# EAGLE design LED-Reorg-SMD (EAGLE 9.1.1)
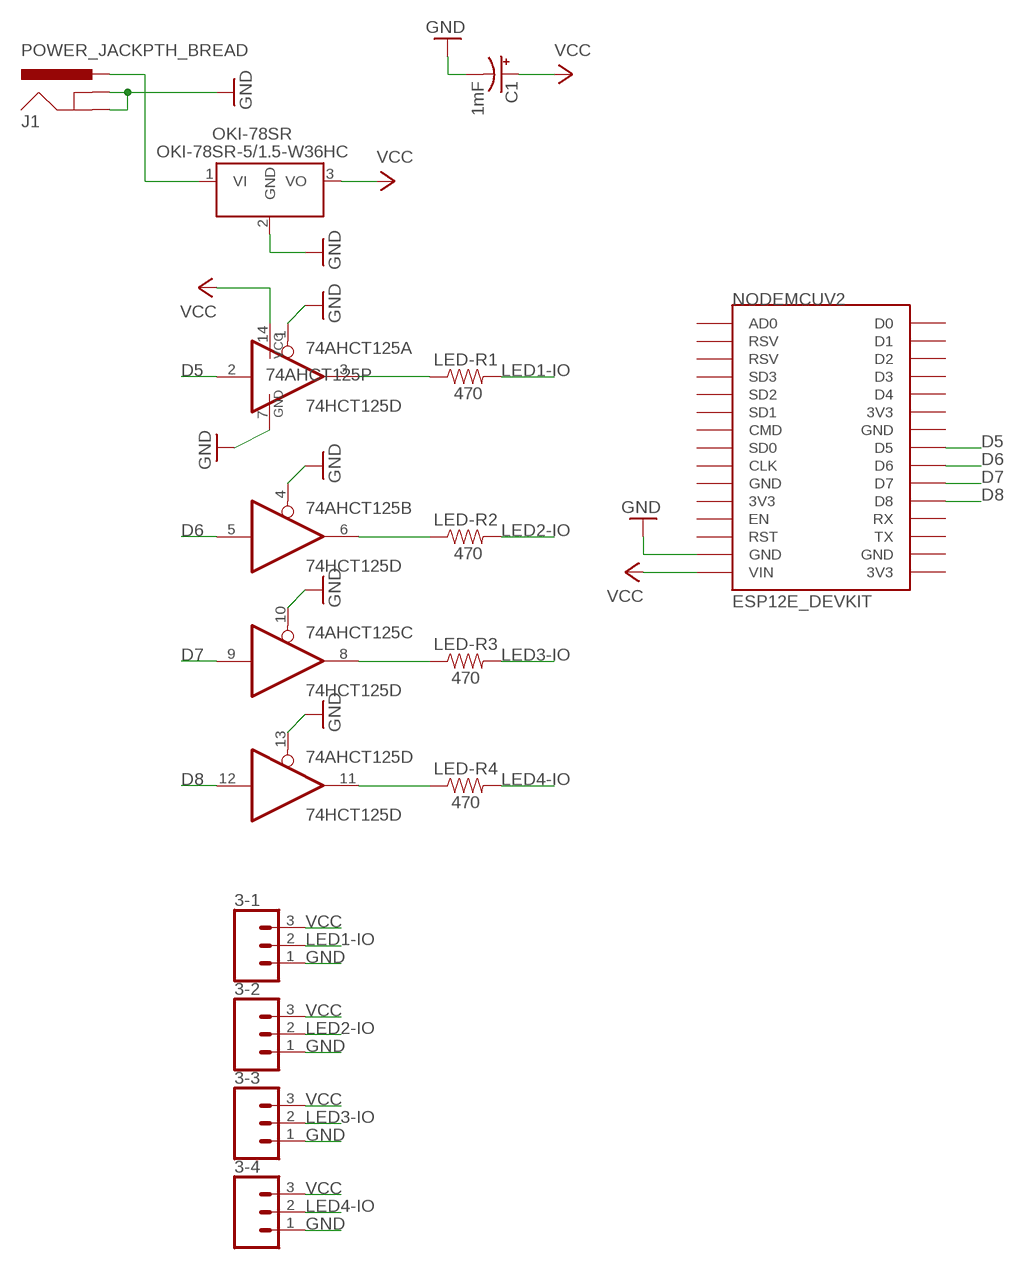
[diagram p0: schematic, sheet 1]

## Parts
3-1  CONN_03SCREW  [SCREWTERMINAL-3.5MM-3]
3-2  CONN_03SCREW  [SCREWTERMINAL-3.5MM-3]
3-3  CONN_03SCREW  [SCREWTERMINAL-3.5MM-3]
3-4  CONN_03SCREW  [SCREWTERMINAL-3.5MM-3]
74AHCT125  74HCT125D  [SO14]
C1  1mF  1000UF-RADIAL-5MM-25V-20%  [CPOL-RADIAL-5MM-10MM]
J1  POWER_JACKPTH_BREAD  [POWER_JACK_PTH_BREAD]
LED-R1  470  RESISTOR1206  [1206]
LED-R2  470  RESISTOR1206  [1206]
LED-R3  470  RESISTOR1206  [1206]
LED-R4  470  RESISTOR1206  [1206]
NODEMCUV2  ESP12E_DEVKIT  [ESP12E_DEVKIT]
OKI-78SR  OKI-78SR-5/1.5-W36HC  [OKI-78SR_HORIZ]

## Nets
D5: 74AHCT125.2(A:I) NODEMCUV2.D5
D6: 74AHCT125.5(B:I) NODEMCUV2.D6
D7: 74AHCT125.9(C:I) NODEMCUV2.D7
D8: 74AHCT125.12(D:I) NODEMCUV2.D8
GND: 3-1.1 3-2.1 3-3.1 3-4.1 74AHCT125.1(A:OE) 74AHCT125.4(B:OE) 74AHCT125.7(P:GND) 74AHCT125.10(C:OE) 74AHCT125.13(D:OE) C1.- J1.GND J1.GNDBREAK NODEMCUV2.GND@1(GND) OKI-78SR.2(GND)
LED1-IO: 3-1.2 LED-R1.2
LED2-IO: 3-2.2 LED-R2.2
LED3-IO: 3-3.2 LED-R3.2
LED4-IO: 3-4.2 LED-R4.2
N$1: 74AHCT125.3(A:O) LED-R1.1
N$2: 74AHCT125.6(B:O) LED-R2.1
N$3: 74AHCT125.8(C:O) LED-R3.1
N$4: 74AHCT125.11(D:O) LED-R4.1
N$10: J1.PWR OKI-78SR.1(VI)
VCC: 3-1.3 3-2.3 3-3.3 3-4.3 74AHCT125.14(P:VCC) C1.+ NODEMCUV2.VIN OKI-78SR.3(VO)
Unconnected: NODEMCUV2.3V3@0(3V3) NODEMCUV2.3V3@1(3V3) NODEMCUV2.3V3@2(3V3) NODEMCUV2.AD0 NODEMCUV2.CLK NODEMCUV2.CMD NODEMCUV2.D0 NODEMCUV2.D1 NODEMCUV2.D2 NODEMCUV2.D3 NODEMCUV2.D4 NODEMCUV2.EN NODEMCUV2.GND@0(GND) NODEMCUV2.GND@2(GND) NODEMCUV2.GND@3(GND) NODEMCUV2.RST NODEMCUV2.RSV@0(RSV) NODEMCUV2.RSV@1(RSV) NODEMCUV2.RX NODEMCUV2.SD0 NODEMCUV2.SD1 NODEMCUV2.SD2 NODEMCUV2.SD3 NODEMCUV2.TX

## Library data of the parts
3-1-3-4 = SparkFun-Connectors:CONN_03: Multi connection point. Often used as Generic Header-pin footprint for 0.1 inch spaced/style header connections On any of the 0.1 inch spaced packages, you can populate with these: Break Away Headers - Straight <https://www.sparkfun.com/products/116> (PRT-00116) Break Away Male Headers - Right Angle <https://www.sparkfun.com/products/553> (PRT-00553) Female Headers <https://www.sparkfun.com/products/115> (PRT-00115) Break Away Headers - Machine Pin <https://www.sparkfun.com/products/117> (PRT-00117) Break Away Female Headers - Swiss Machine Pin <https://www.sparkfun.com/products/743> (PRT-00743) Stackable Header - 3 Pin (Female, 0.1") <https://www.sparkfun.com/products/13875> (PRT-13875) For SCREWTERMINALS and SPRING TERMINALS visit here: Screw Terimnals on SparkFun.com <https://www.sparkfun.com/search/results?term=Screw+Terminals> (5mm/3.5mm/2.54mm spacing) This device is also useful as a general connection point to wire up your design to another part of your project. Our various solder wires solder well into these plated through hole pads. Hook-Up Wire - Assortment (Stranded, 22 AWG) <https://www.sparkfun.com/products/11375> (PRT-11375) Hook-Up Wire - Assortment (Solid Core, 22 AWG) <https://www.sparkfun.com/products/11367> (PRT-11367) View the entire wire category on our website here <https://www.sparkfun.com/categories/141> Special notes: Molex polarized connector foot print use with SKU : PRT-08232 with associated crimp pins and housings.; PROD_ID: CONN-08288; SF_ID: PRT-08235
74AHCT125 = 74xx-eu:74*125: Quad bus BUFFER, 3-state
C1 = SparkFun-Capacitors:1000UF: 1,000µF/1mF ceramic capacitors A capacitor is a passive two-terminal electrical component used to store electrical energy temporarily in an electric field. CAP-08070; PROD_ID: CAP-09538
J1 = SparkFun-Connectors:POWER_JACK: Power Jack Connector This is the standard 5.5mm barrel jack for power. The PTH is the most common, proven, reliable, footprint. The Slot footprint only works if the mill layer is transmitted to the PCB fab house so be warned. Here are the connectors we sell at SparkFun: DC Barrel Power Jack/Connector <https://www.sparkfun.com/products/119> (PRT-00119) DC Barrel Power Jack/Connector (SMD) <https://www.sparkfun.com/products/12748> (PRT-12748) DC Barrel Jack Adapter - Breadboard Compatible <https://www.sparkfun.com/products/10811> (PRT-10811) It is used on this SparkFun product (and many, many others): SparkFun RedBoard - Programmed with Arduino <https://www.sparkfun.com/products/12757> (DEV-12757) Also, if you need a mating power supply or connector, please check these out: Wall Adapter Power Supply - 9VDC 650mA <https://www.sparkfun.com/products/298> (TOL-00298) DC Barrel Jack Adapter - Male <https://www.sparkfun.com/products/10287> (PRT-10287); PROD_ID: PRT-10811
LED-R1-LED-R4 = SparkFun-Resistors:RESISTOR: Generic Resistor Package
NODEMCUV2 = ESP12E_DEVKIT:ESP12E_DEVKIT: ESP12E DEVKIT BOARD
OKI-78SR = MRDT-ICs:OKI-78SR-*/1.5-W36?C: 4.95W DC/DC Converter Manufacturer: Murata; VOUT: +5v

## Board
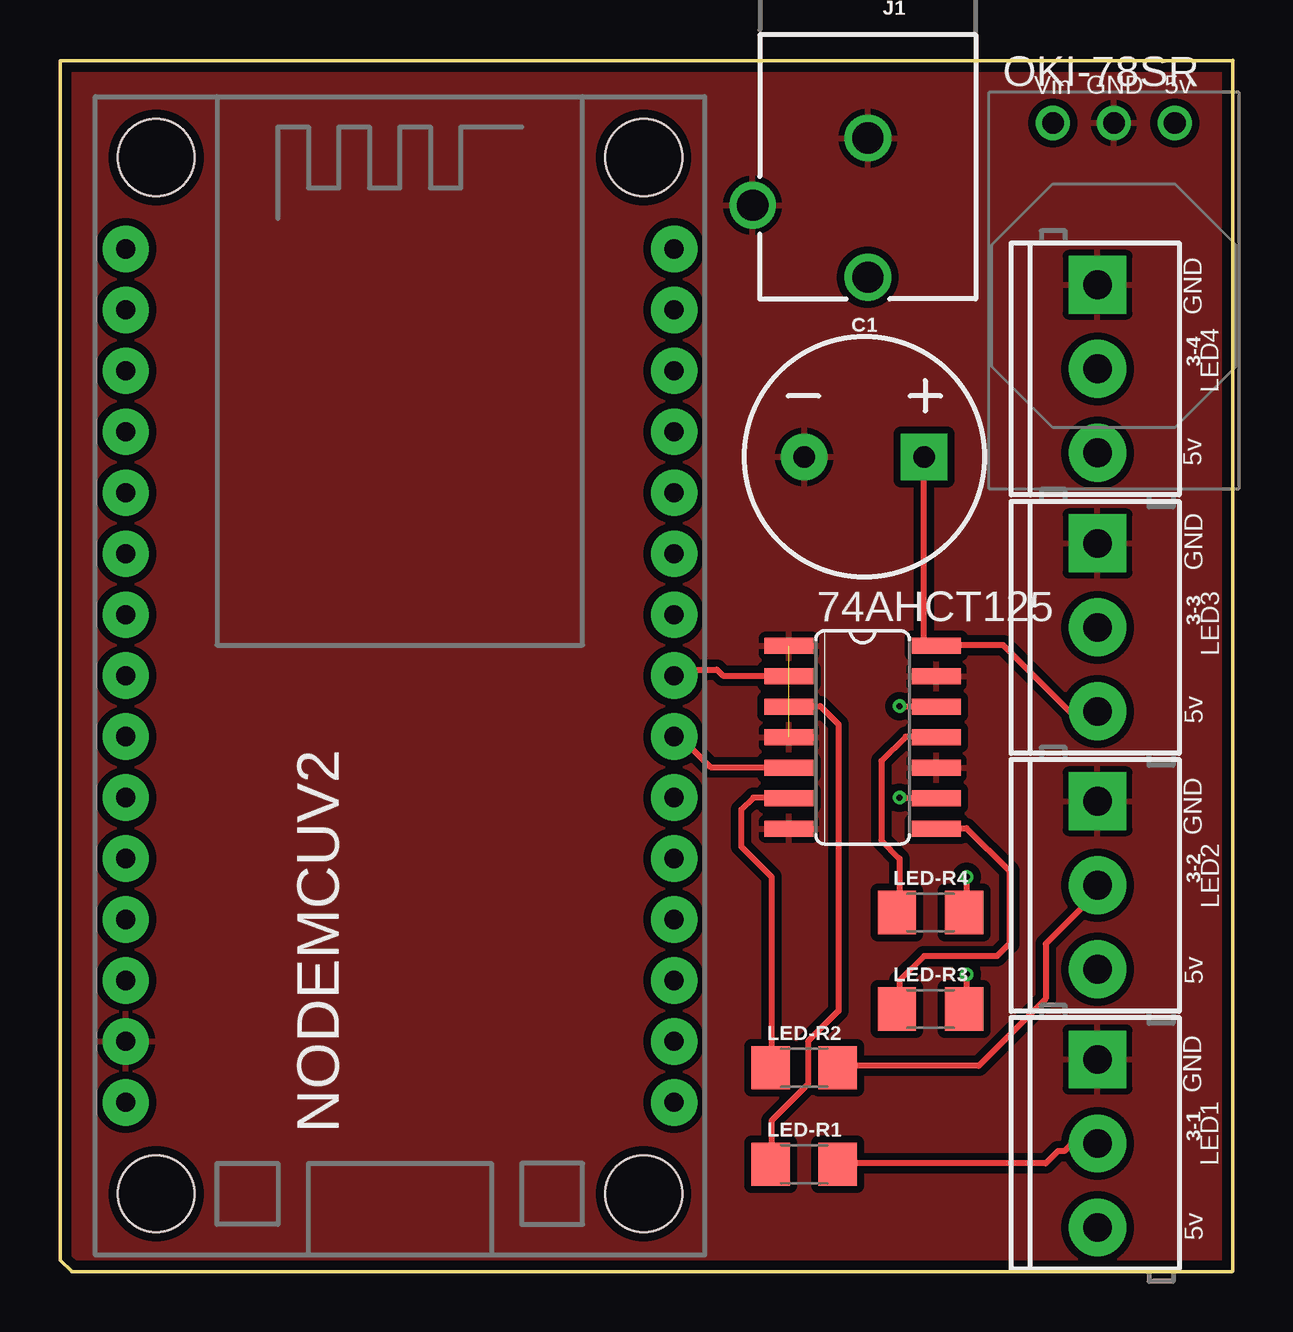
[diagram p1: board, top side]
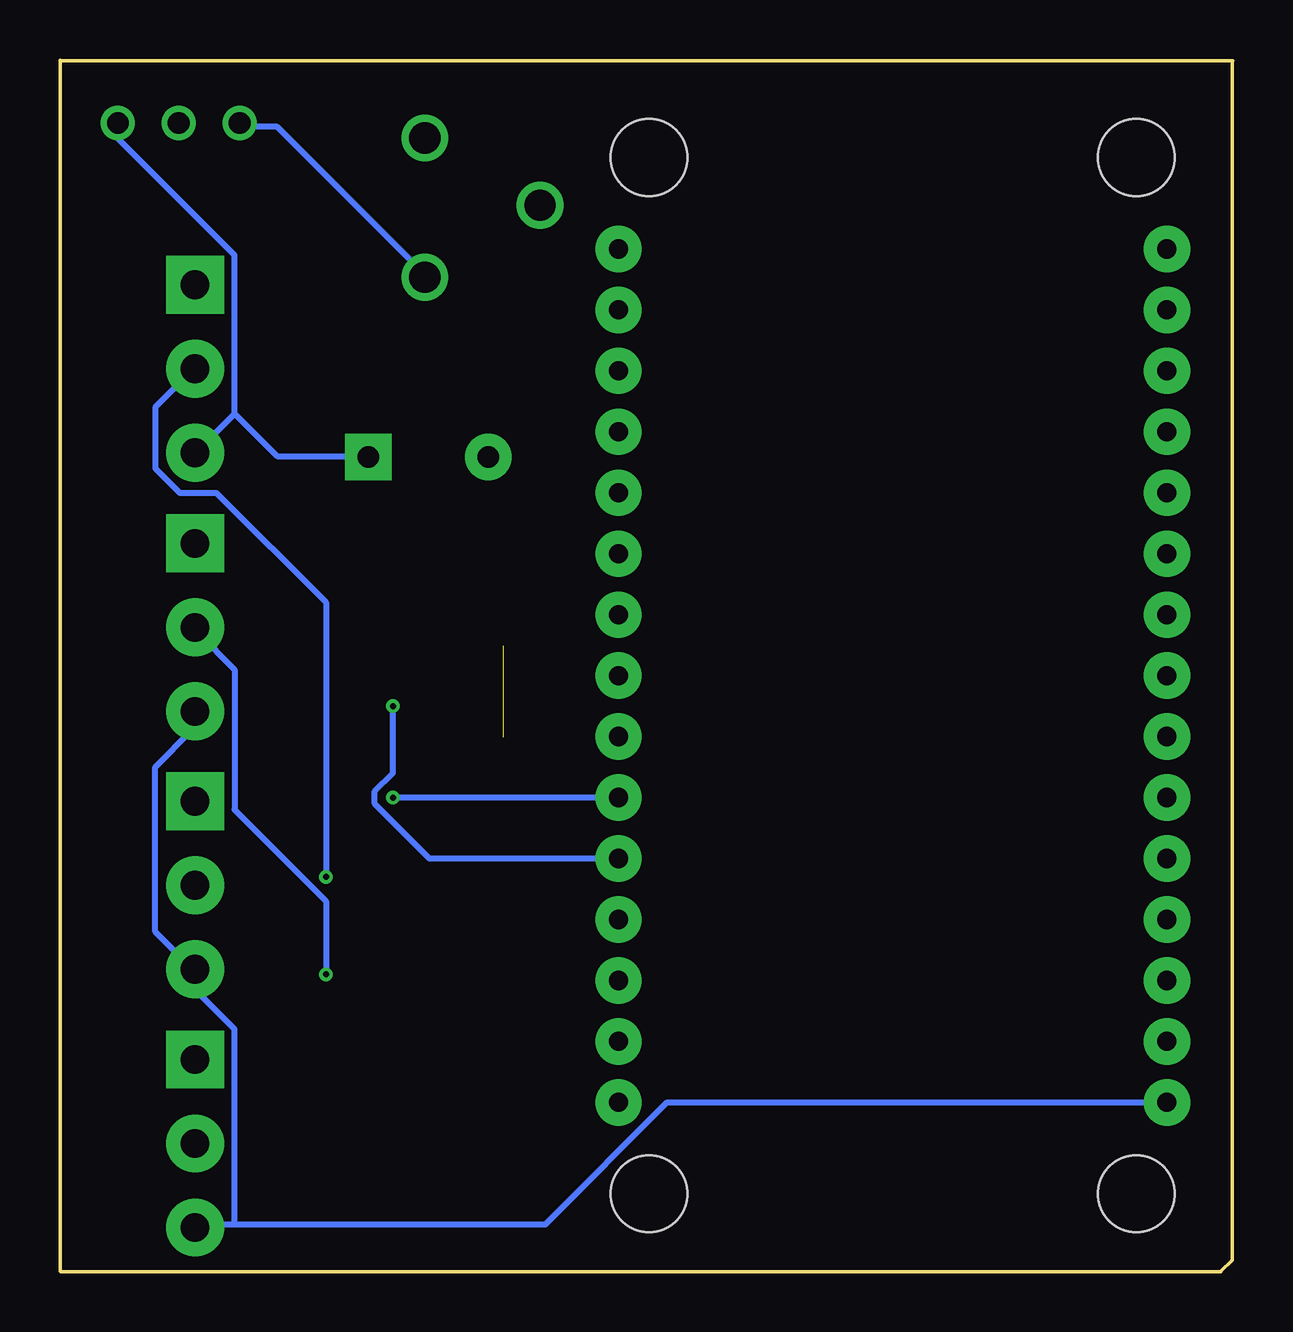
[diagram p2: board, bottom side, seen from below]

Size 48.88 x 50.49 mm. Coordinates in mm from the lower left corner, seen from the top.
Outline: 0.01,50.43 0.01,0.51 0.03,0.49
Outline: 0,50.47 48.86,50.47 48.88,50.49 48.88,0.03 48.85,0 0.53,0 0.52,0
Outline: 0.02,0.49 0.5,0.01 0.5,0.01
Copper layers (1*16): Top 0.035559375mm / dielectric 1.6mm / Bottom 0.035559375mm
Design rules "oshpark-2layer-auto-routing": minimum track width 10mil, minimum drill 10mil, track to track 10mil, track to pad 8mil, pad to pad 8mil, via to via 8mil, smd to smd 6mil, copper to edge 15mil, drill to drill 6mil, minimum pad ring 6mil, minimum via ring 6mil, stop-mask expansion 2.5mil, vias tented up to drill 0mil, thermal gap 10mil

### Footprints (pad centres in the part's own frame; a part is rotated, then mirrored left to right if it is on the bottom)
SCREWTERMINAL-3.5MM-3 = drill 1.2 pad 2.413 square: 1 0,0 | drill 1.2 pad 2.413: 2 3.5,0; 3 7,0
SO14 = smd 0.66 x 2.032: 1 -3.81,-3.073; 2 -2.54,-3.073; 3 -1.27,-3.073; 4 0,-3.073; 5 1.27,-3.073; 6 2.54,-3.073; 7 3.81,-3.073; 8 3.81,3.073; 9 2.54,3.073; 10 1.27,3.073; 11 0,3.073; 12 -1.27,3.073; 13 -2.54,3.073; 14 -3.81,3.073
CPOL-RADIAL-5MM-10MM = drill 0.9 pad 1.93 square: + 2.5,0 | drill 0.9 pad 1.93: - -2.5,0
POWER_JACK_PTH_BREAD = drill 1.3: GND 0,7.9; GNDBREAK 4.8,10.7; PWR 0,13.7
1206 = smd 1.6 x 1.8: 1 -1.4,0; 2 1.4,0
ESP12E_DEVKIT = drill 0.8 pad 1.93: 3V3@0 -11.43,-7.62; 3V3@1 11.43,5.08; 3V3@2 11.43,-17.78; AD0 -11.43,17.78; CLK -11.43,-2.54; CMD -11.43,2.54; D0 11.43,17.78; D1 11.43,15.24; D2 11.43,12.7; D3 11.43,10.16; D4 11.43,7.62; D5 11.43,0; D6 11.43,-2.54; D7 11.43,-5.08; D8 11.43,-7.62; EN -11.43,-10.16; GND@0 -11.43,-5.08; GND@1 -11.43,-15.24; GND@2 11.43,2.54; GND@3 11.43,-15.24; RST -11.43,-12.7; RSV@0 -11.43,15.24; RSV@1 -11.43,12.7; RX 11.43,-10.16; SD0 -11.43,0; SD1 -11.43,5.08; SD2 -11.43,7.62; SD3 -11.43,10.16; TX 11.43,-12.7; VIN -11.43,-17.78 | hole 3.2: -10.16,21.59; 10.16,21.59; 10.16,-21.59; -10.16,-21.59
OKI-78SR_HORIZ = drill 0.9 pad 1.422: 1 0,0; 2 -2.54,0; 3 -5.08,0

### Placement (x,y rotation side)
3-1  43.25,8.85 270 top
3-2  43.25,19.6 270 top
3-3  43.25,30.35 270 top
3-4  43.25,41.12 270 top
74AHCT125  33.46,22.27 270 top
C1  33.53,33.95 0 top
J1  33.67,55.14 180 top
LED-R1  31.02,4.48 0 top
LED-R2  31.02,8.5 0 top
LED-R3  36.29,10.95 0 top
LED-R4  36.29,14.97 0 top
NODEMCUV2  14.17,24.84 0 top
OKI-78SR  41.39,47.87 180 top

### Tracks (layer width: path | path; a pad name or v marks a point on that pad's centre or on a via)
D5
  Top 0.254: NODEMCUV2.D5 25.85,25.09 27.38,25.09 27.63,24.84 30.17,24.84 74AHCT125.2
D6
  Top 0.254: NODEMCUV2.D6 25.85,22.3 27.12,21.03 30.17,21.03 74AHCT125.5
D7  (via drill 0.25)
  Top 0.254: v35,19.76 36.52,19.76 74AHCT125.9
  Bottom 0.254: NODEMCUV2.D7 v35,19.76
D8  (via drill 0.25)
  Top 0.254: v35,23.57 36.52,23.57 74AHCT125.12
  Bottom 0.254: v35,23.57 35,20.77 35.76,20.01 35.76,19.5 33.47,17.22 NODEMCUV2.D8
GND  (1 unrouted)
  pour Top (isolate 0.305): 0.01,0.52 0.01,50.46 0.01,50.46 48.87,50.46 48.87,50.47 48.87,0.03 48.85,0.01 0.5,0.01 0.03,0.49
LED1-IO
  Top 0.254: LED-R1.2 32.46,4.52 41.09,4.52 41.6,5.03 41.86,5.03 42.11,5.28 43.13,5.28 3-1.2
LED2-IO
  Top 0.254: LED-R2.2 32.46,8.58 38.3,8.58 41.09,11.38 41.09,13.66 43.38,15.95 3-2.2
LED3-IO  (via drill 0.25)
  Top 0.254: v37.79,12.39 37.79,11.12 LED-R3.2
  Bottom 0.254: v37.79,12.39 37.79,15.44 41.6,19.25 41.6,25.09 43.13,26.62 3-3.2
LED4-IO  (via drill 0.25)
  Top 0.254: v37.79,16.46 37.79,15.19 LED-R4.2
  Bottom 0.254: v37.79,16.46 37.79,27.89 42.36,32.46 43.89,32.46 44.9,33.47 44.9,36.01 43.38,37.54 3-4.2
N$1
  Top 0.254: LED-R1.1 29.66,4.52 29.66,6.3 31.19,7.82 31.19,9.6 32.46,10.87 32.46,22.81 31.7,23.57 30.43,23.57 74AHCT125.3
N$2
  Top 0.254: LED-R2.1 29.66,8.58 29.66,16.46 28.39,17.73 28.39,19.25 28.9,19.76 30.17,19.76 74AHCT125.6
N$3
  Top 0.254: LED-R3.1 35,11.12 35,12.14 36.01,13.15 39.06,13.15 39.57,13.66 39.57,16.71 37.79,18.49 36.78,18.49 74AHCT125.8
N$4
  Top 0.254: LED-R4.1 35,15.19 35,17.22 34.24,17.98 34.24,21.28 35.25,22.3 36.52,22.3 74AHCT125.11
N$10
  Bottom 0.254: OKI-78SR.1 41.35,47.7 39.82,47.7 33.73,41.6 J1.PWR
VCC
  Top 0.254: 3-3.3 43.13,23.31 42.11,23.31 39.32,26.11 36.78,26.11 74AHCT125.14 36.52,25.85 36.01,26.36 36.01,33.73 C1.+
  Bottom 0.254: 41.6,35.76 41.6,42.36 46.43,47.19 46.43,47.7 OKI-78SR.3 | 41.6,35.76 43.13,34.24 3-4.3 | 41.6,35.76 39.82,33.98 36.27,33.98 C1.+ | NODEMCUV2.VIN 23.57,7.06 28.65,1.98 41.6,1.98 | 41.6,1.98 43.13,1.98 3-1.3 | 41.6,1.98 41.6,10.11 43.13,11.63 43.13,12.39 3-2.3 43.38,12.65 44.9,14.17 44.9,21.03 43.38,22.55 43.38,23.31 3-3.3

### Text on the board
tNames: Vin | GND | 5v | GND | LED4 | 5v | GND | LED3 | 5v | GND | LED2 | 5v | GND | LED1 | 5v